# EasyEDA Pro project AUTO_TOOL_VINF_2025-05-17.epro, board PCB1
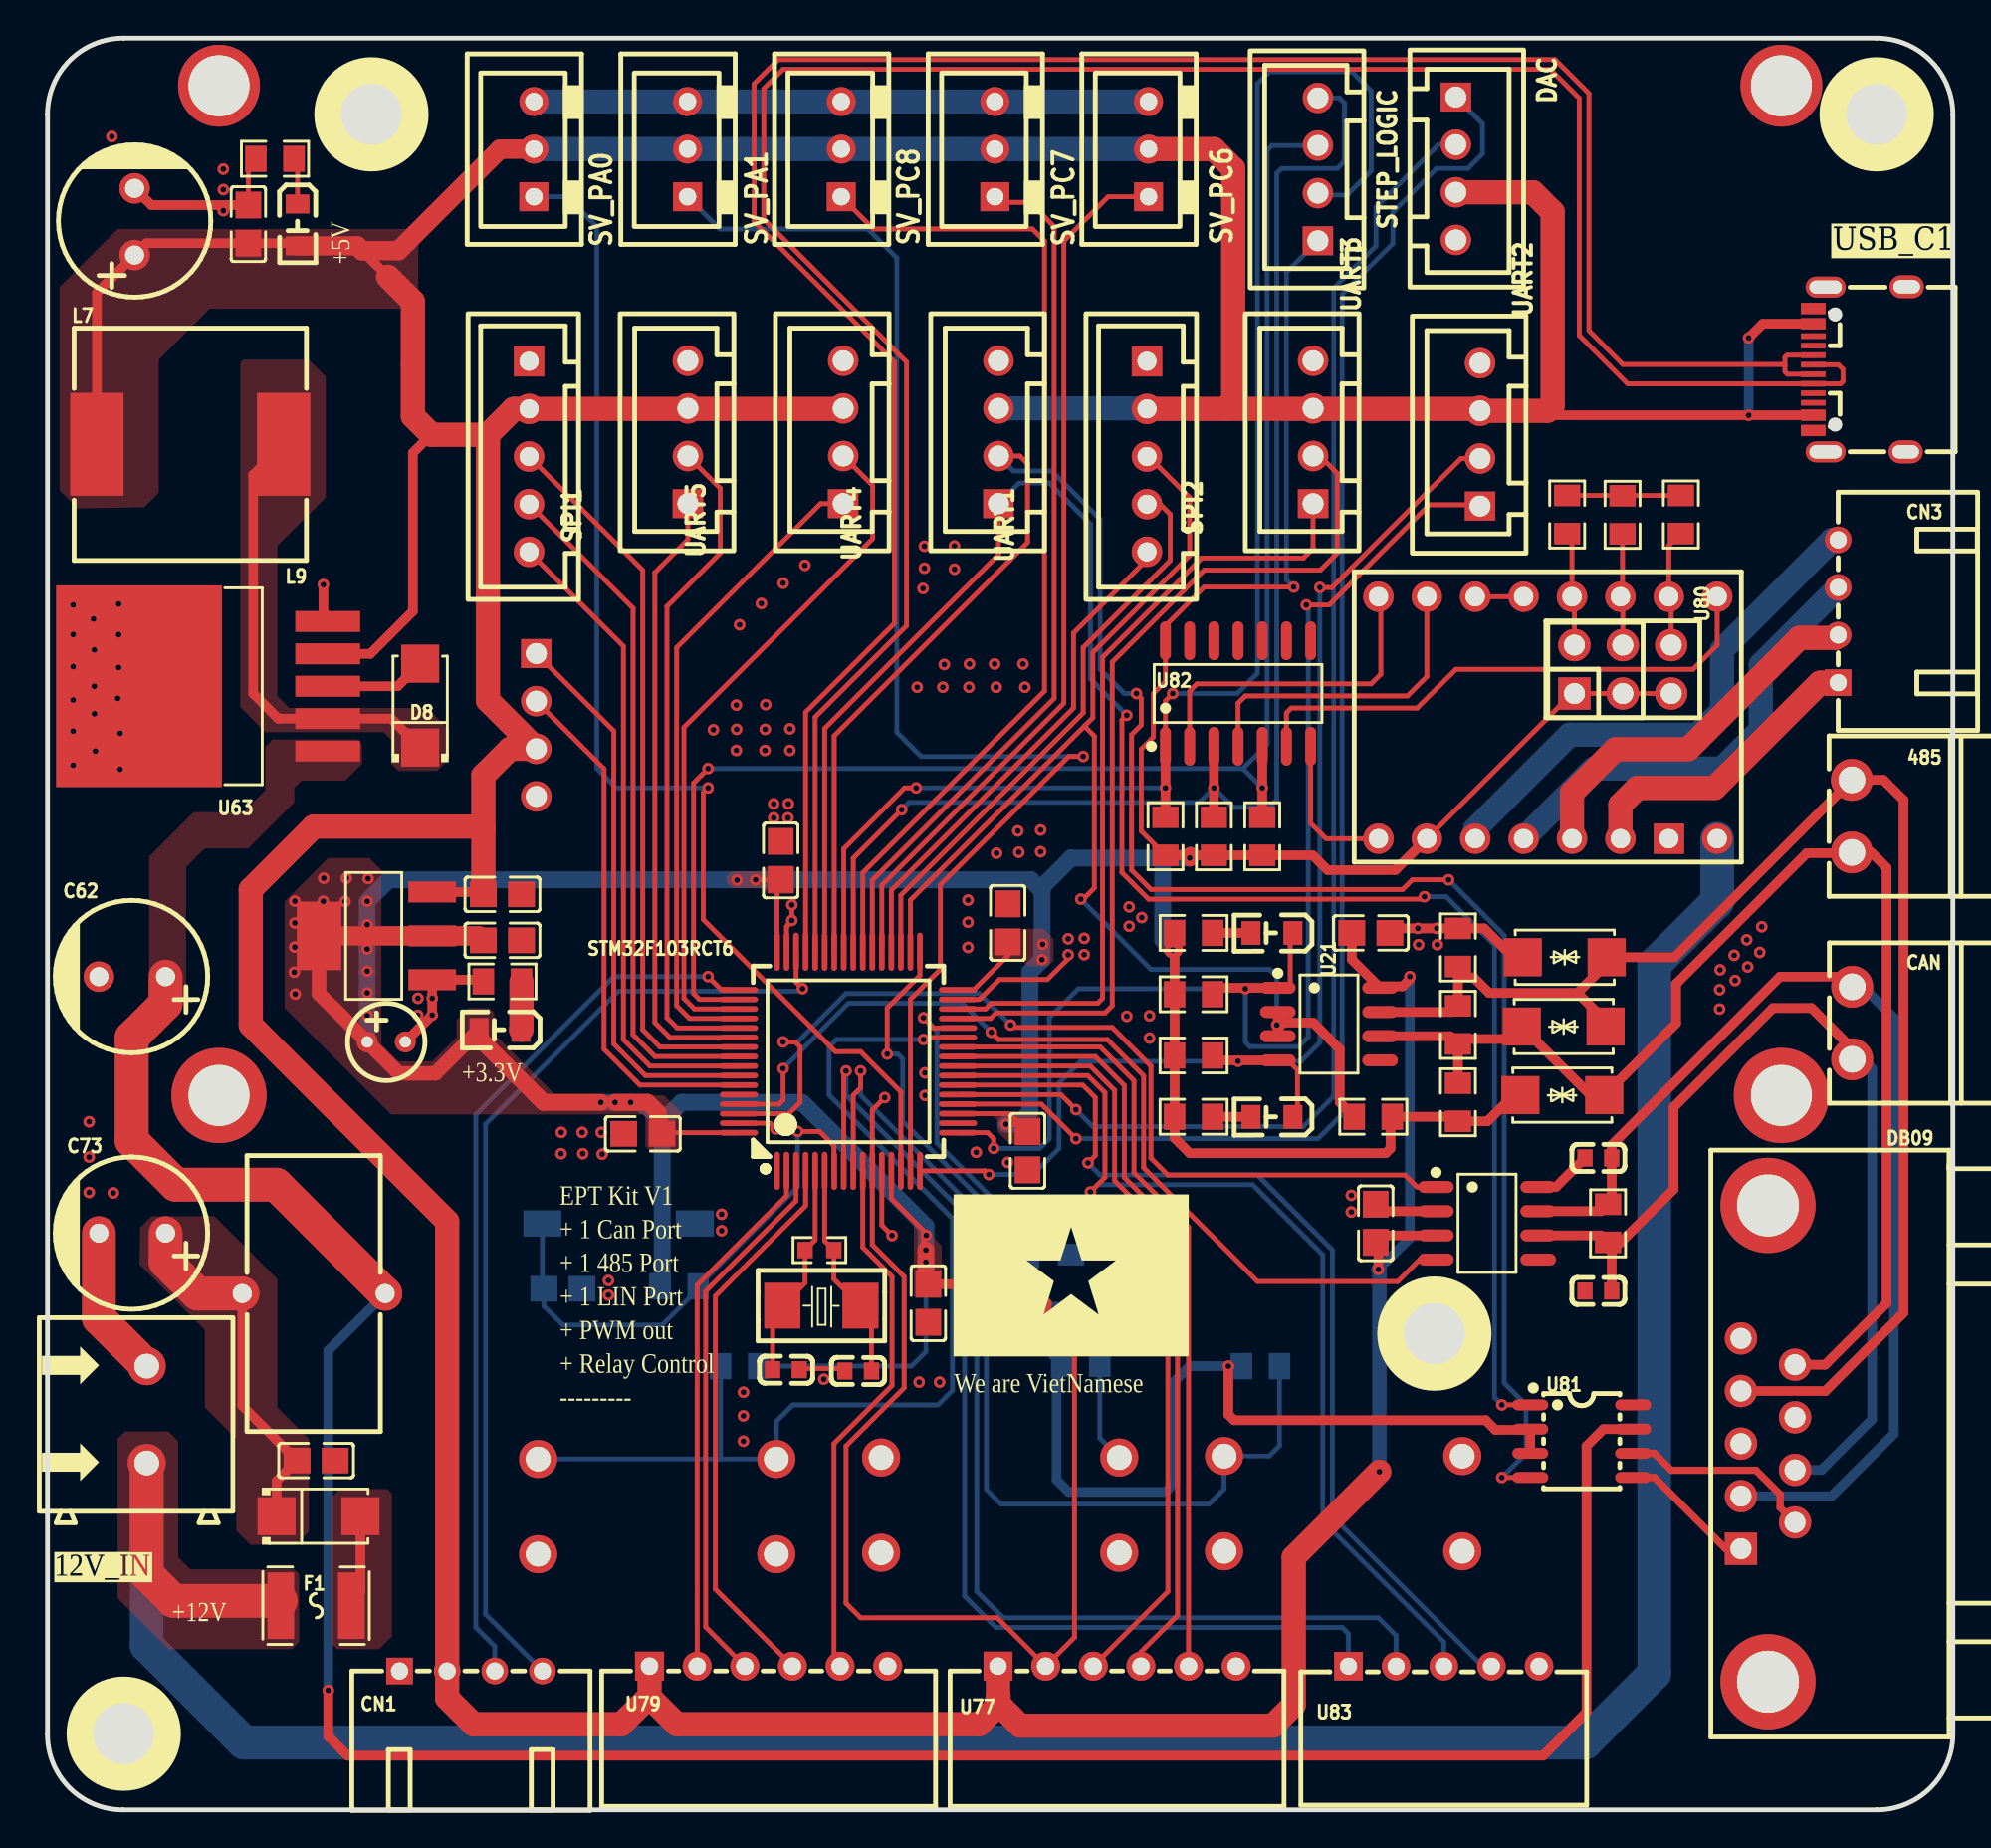
[diagram p1: board, top side]
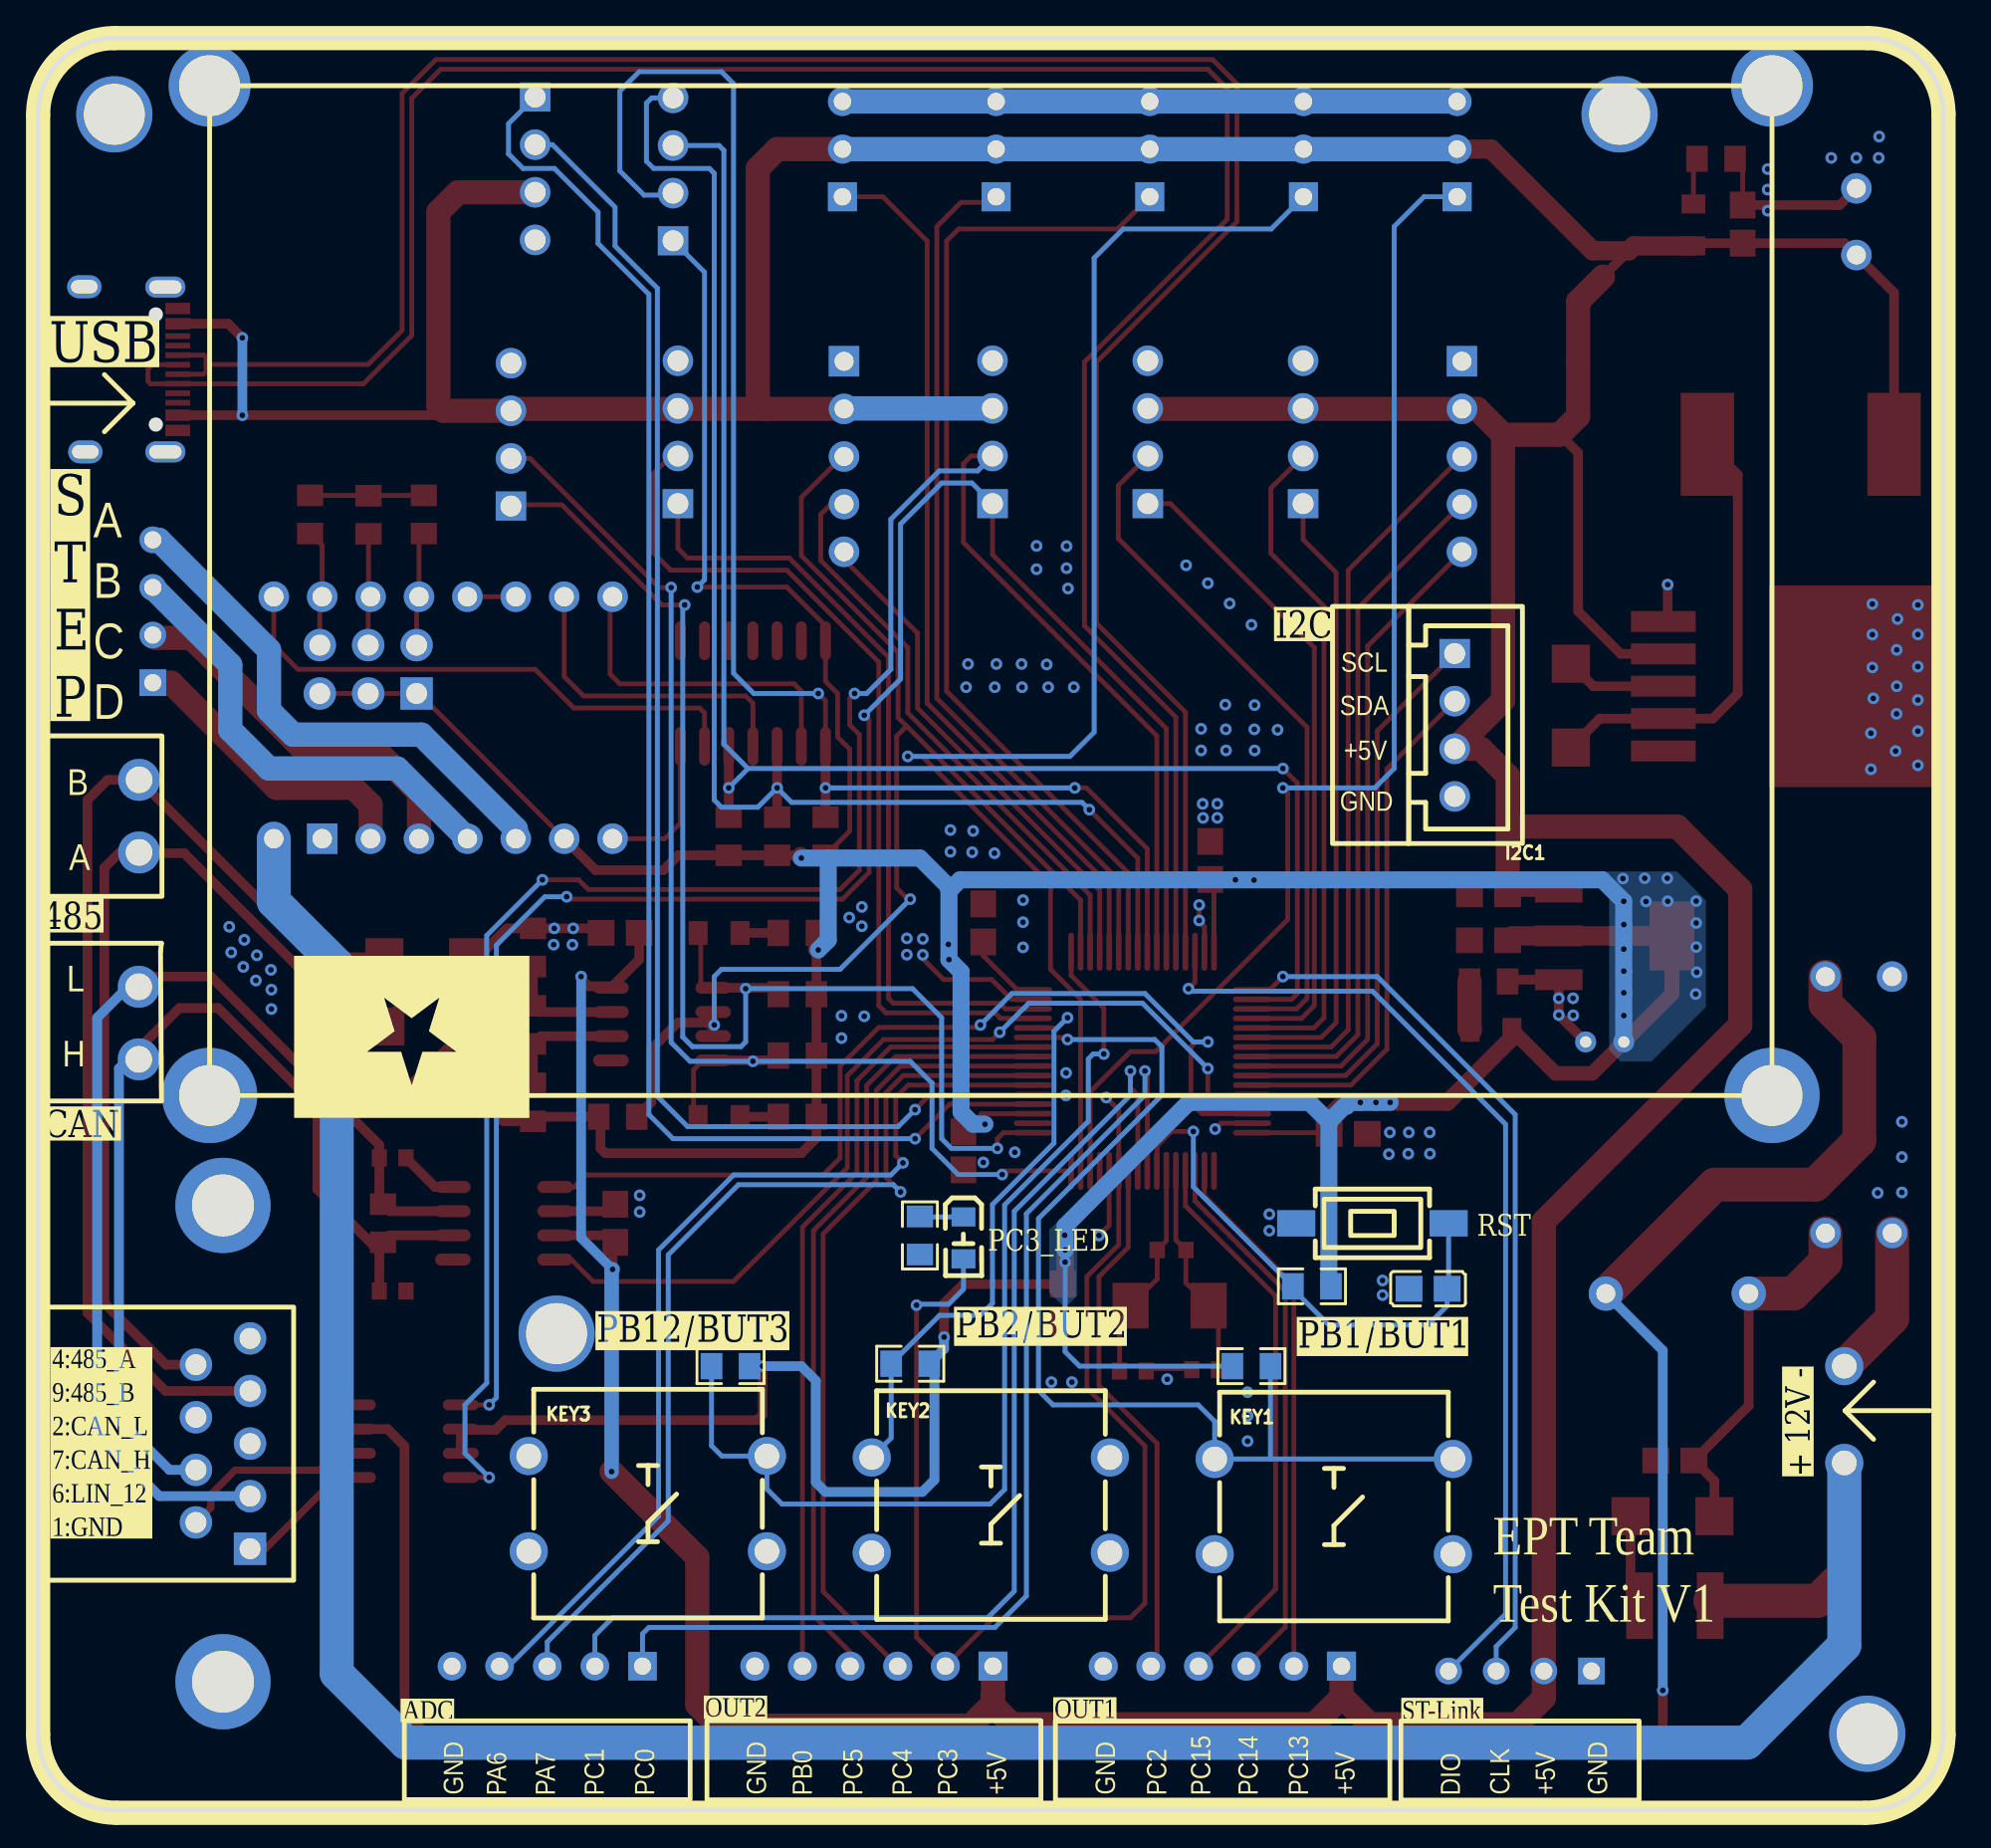
[diagram p2: board, bottom side, seen from below]

Outline 100 x 93 mm; copper layers: Top Layer, Bottom Layer. Coordinates in mm from the lower left corner of the outline.
Outline path: 0,89 arc(1.17,91.83) 4,93 95.98,93 arc(98.82,91.82) 100,88.98 100,4 arc(98.83,1.17) 96,0 3.95,0 arc(1.16,1.16) 0,3.95 0,89
Stack: Top Layer 0.035mm / Dielectric1 1.51mm FR4 er 4.5 / Bottom Layer 0.035mm

## Design rules (mm)
template: Custom Config
spacing copperThickness1oz (default): track to track 0.102, other pairs 0.152 to 0.3
spacing copperThickness2oz: track to track 0.203, other pairs 0.152 to 0.3
track width copperThickness1oz (default): min 0.127, default 0.254, max 2.54
track width copperThickness2oz: min 0.203, default 0.254, max 2.54
differential pair differentialPair (default): width min 0.127, default 0.254, max 2.54; gap min 0.152, default 0.152
via viaSize (default): diameter min 0.5, default 0.61, max 10; hole min 0.3, default 0.305, max 6.3

## Placement (name value [footprint] x y rotation side)
3.3V  17-21SURC/S530-A3/4T  [LED0805-RD_ORANGE]  23.75 40.94 180 top
5V  17-21SURC/S530-A3/4T  [LED0805-RD_ORANGE]  13.12 83.19 270 top
12V_IN  5.08  [CONN-TH_2P-P5.00_WJ500V-5.08-2P]  5.21 20.75 90 top
485  2EDG-3.81-2AW  [CONN-TH_2EDG-3.81-2AW]  94.7 52.16 90 top
C1  22pF  [C0603]  38.75 23.11 180 top
C2  22pF  [C0603]  42.54 23.04 0 top
C19  10uF  [C0805]  23.88 48.06 180 top
C20  100nF  [C0805]  23.88 45.64 0 top
C62  220uF  [CAP-TH_BD8.0-P3.50-D0.6-FD_1]  4.44 43.74 180 top
C63  470uF  [CAP-TH_BD8.0-P3.50-D0.5-FD]  4.57 83.36 90 top
C71  30pF  [C0603]  81.39 34.22 0 top
C72  30pF  [C0603]  81.39 27.24 0 top
C73  220uF  [CAP-TH_BD8.0-P3.50-D0.6-FD_1]  4.44 30.28 180 top
C82  100nF  [C0805]  69.71 30.79 270 top
C84  100nF  [C0805]  10.54 83.24 90 top
C85  100nF  [C0805]  50.39 46.56 90 top
C86  100nF  [C0805]  38.48 49.83 90 top
C87  100nF  [C0805]  51.44 34.59 270 top
C88  100nF  [C0805]  46.23 26.59 270 top
C89  100nF  [C0805]  27.05 27.36 0 bottom
C90  100nF  [C0805]  69.45 46.03 0 top
C93  100nF  [C0805]  14.1 18.34 180 top
C94  100nF  [C0805]  31.24 35.48 180 top
CAN  2EDG-3.81-2AW  [CONN-TH_2EDG-3.81-2AW]  94.72 41.3 90 top
CN1  XD-XH-4AW-G  [CONN-TH_XD-XH-4AW-G]  22.22 7.29 0 top
CN3  STEP  [CONN-TH_XD-XH-4AW-G]  93.98 62.92 90 top
D8  SS34  [SMA_L4.3-W2.6-LS5.2-RD]  19.56 57.96 90 top
D11  SS34  [SMA_L4.3-W2.6-LS5.2-RD]  14.22 15.42 0 top
DAC  ZX-XH2.54-4PZZ  [CONN-TH_4P-P2.50_4PIN]  73.91 86.16 270 top
DB09  DP9  [DSUB-TH_DMR-9P]  90.3 19.23 0 top
F1  BSMD1812-110-24V  [F1812]  14.1 10.72 0 top
H1  PZ254V-12-6P  [HDR-TH_6P-P2.54-V-M-R2-C3-S2.54]  82.68 59.87 0 top
I2C1  ZX-XH2.54-4PZZ  [CONN-TH_4P-P2.50_4PIN]  25.65 56.95 270 bottom
KEY1  B3F-4055  [KEY-TH_4P-L12.0-W12.0-P5.00-LS13.4-EH]  32 15.92 180 bottom
KEY2  B3F-4055  [KEY-TH_4P-L12.0-W12.0-P5.00-LS13.4-EH]  50 16 180 bottom
KEY3  B3F-4055  [KEY-TH_4P-L12.0-W12.0-P5.00-LS13.4-EH]  68 16.07 180 bottom
L7  33uH  [IND-SMD_L12.0-W12.0]  7.49 71.68 0 top
L9  47uH  [IND-TH_L14.5-W7.0-P7.0-D0.6_XR5026T470MVL7]  13.97 27.1 0 top
LED1  17-21SURC/S530-A3/4T  [LED0805-RD_ORANGE]  64.26 36.37 180 top
LED2  17-21SURC/S530-A3/4T  [LED0805-RD_ORANGE]  64.26 46.03 180 top
LED7  17-21SURC/S530-A3/4T  [LED0805-RD_ORANGE]  51.44 30.02 270 bottom
NOREF  -  [Pad_e121]  91 90.5 0 top
NOREF#2  -  [Pad_e2593]  4 4 0 top
NOREF#3  -  [Pad_e2634]  72.79 25 0 top
NOREF#4  -  [Pad_e2590]  96 89 0 top
NOREF#5  -  [Pad_e122]  91 37.5 0 top
NOREF#6  -  [Pad_e2631]  17 89 0 top
NOREF#7  -  [Pad_e123]  9 37.5 0 top
NOREF#8  -  [Pad_e117]  9 90.5 0 top
R32  1MΩ  [R0603]  40.51 29.39 180 top
R82  120Ω  [R0805]  81.9 30.79 90 top
R84  1kΩ  [R0805]  23.88 43.48 0 top
R87  1kΩ  [R0805]  11.94 86.66 0 top
R88  10K  [R0805]  33.15 27.48 180 bottom
R89  1kΩ  [R0805]  60.15 36.38 180 top
R90  1kΩ  [R0805]  60.15 46.03 180 top
R91  10kΩ  [R0805]  60.15 39.6 180 top
R92  10kΩ  [R0805]  69.58 36.38 0 top
R93  10kΩ  [R0805]  60.15 42.81 180 top
R94  47kΩ  [R0805]  74.03 37.14 90 top
R95  47kΩ  [R0805]  74.03 41.21 90 top
R96  47kΩ  [R0805]  74.03 45.27 90 top
R97  1kΩ  [R0805]  53.72 30.15 90 bottom
R98  10kΩ  [R0805]  36.32 23.29 0 bottom
R99  10kΩ  [R0805]  54.23 23.42 180 bottom
R100  10kΩ  [R0805]  63.66 23.29 180 bottom
R101  10K  [R0805]  63.75 51.11 270 top
R102  10K  [R0805]  61.21 51.11 270 top
R103  10K  [R0805]  58.67 51.11 270 top
R104  10K  [R0805]  79.76 68 90 top
R105  10K  [R0805]  82.66 67.98 90 top
R106  10K  [R0805]  85.72 68 90 top
RST1  RST  [SW-SMD_L6.1-W3.6-LS8.0]  29.97 30.78 180 bottom
SPI1  XY-XH2.54-5A11  [HDR-TH_5P-P2.50-V-F-2]  25.27 71.04 270 top
SPI2  XY-XH2.54-5A11  [HDR-TH_5P-P2.50-V-F-2]  57.7 71.04 270 top
STEP_LOGIC  ZX-XH2.54-4PZZ  [CONN-TH_4P-P2.50_4PIN]  66.68 86.11 90 top
STM32F103RCT6  GD32F103RCT6  [LQFP-64_L10.0-W10.0-P0.50-LS12.0-BL]  42.04 39.29 0 top
U5  AMS1117-3.3  [SOT-223-3_L6.5-W3.5-P3.05-LS7.0]  17.22 45.88 0 top
U6  22uF  [CAP-TH_BD4.0-P2.00-D0.5-FD]  17.78 40.31 0 top
U21  MAX485ED  [SOP-8_L4.9-W3.9-P1.27-LS6.0-BL]  67.25 41.25 270 top
U24  SMAJ6.8CA  [SMA_L4.3-W2.6-LS5.1-BI]  79.57 41.12 0 top
U25  SMAJ6.8CA  [SMA_L4.3-W2.6-LS5.1-BI]  79.63 44.75 180 top
U26  SMAJ6.8CA  [SMA_L4.3-W2.6-LS5.1-BI]  79.5 37.52 0 top
U63  LM2596R-5.0  [TO-263-5_L10.2-W8.6-P1.70-LS14.4-TL]  9.75 58.98 180 top
U68  TJA1050DRG  [SOP-8_L4.9-W3.9-P1.27-LS6.0-BL]  75.55 30.79 270 top
U71  XH2.54_3P  [CONN-TH_3P-P2.50_BX-XH2.54-3PZZ]  25.53 87.17 90 top
U72  BX-XH2.54-3PZZ  [CONN-TH_3P-P2.50_BX-XH2.54-3PZZ]  41.66 87.17 90 top
U74  BX-XH2.54-3PZZ  [CONN-TH_3P-P2.50_BX-XH2.54-3PZZ]  49.72 87.17 90 top
U75  BX-XH2.54-3PZZ  [CONN-TH_3P-P2.50_BX-XH2.54-3PZZ]  33.59 87.17 90 top
U76  BX-XH2.54-3PZZ  [CONN-TH_3P-P2.50_BX-XH2.54-3PZZ]  57.78 87.17 90 top
U77  6P_RELAY  [CONN-TH_6P-P2.50_WAFER-XH254WZ-6A]  56.13 7.54 0 top
U79  6P_RELAY  [CONN-TH_6P-P2.50_WAFER-XH254WZ-6A]  37.85 7.54 0 top
U80  A4988  [DIP-16_L20.3-W15.2-P2.54_LS12.7_A4988]  78.74 57.33 270 top
U81  TJA1021T/20/C,118  [SO-8_L4.9-W3.9-P1.27-LS5.9-BL]  80.52 19.35 270 top
U82  74HC14  [SOIC-14_L8.7-W3.9-P1.27-LS6.0-BL]  62.48 58.6 0 top
U83  5P_ADC  [CONN-TH_5P-P2.50_WAFER-XH254WZ-5A]  73.28 7.54 0 top
UART1  ZX-XH2.54-4PZZ  [CONN-TH_4P-P2.50_4PIN]  49.91 72.31 90 top
UART2  ZX-XH2.54-4PZZ  [CONN-TH_4P-P2.50_4PIN]  75.18 72.19 90 top
UART3  ZX-XH2.54-4PZZ  [CONN-TH_4P-P2.50_4PIN]  66.42 72.31 90 top
UART4  ZX-XH2.54-4PZZ  [CONN-TH_4P-P2.50_4PIN]  41.76 72.31 90 top
UART5  ZX-XH2.54-4PZZ  [CONN-TH_4P-P2.50_4PIN]  33.61 72.31 90 top
USB_C1  918-418K2023S40001  [USB-C-SMD_TYPE-C-USB-17]  95.12 75.62 90 top
X1  8MHz  [OSC-SMD_L5.0-W3.2]  40.62 26.47 0 top

## Footprints (pads in the part's own frame, mm; a bottom-side part is the same pattern mirrored in y, then rotated)
C0603
  rect 0.8x0.9 smd: 1(-0.7,0) 2(0.7,0)
C0805
  rect 1.41x1.35 smd: 1(-1,0) 2(1,0)
CAP-TH_BD4.0-P2.00-D0.5-FD
  round 1.1 hole 0.6: 1(-1,0) 2(1,0)
CAP-TH_BD8.0-P3.50-D0.5-FD
  round 1.6 hole 1: 1(-1.75,0) 2(1.75,0)
CAP-TH_BD8.0-P3.50-D0.6-FD_1
  round 1.6 hole 1: 1(-1.75,0) 2(1.75,0)
CONN-TH_2EDG-3.81-2AW
  round 2.2 hole 1.4: 1(-1.905,0) 2(1.905,0)
CONN-TH_2P-P5.00_WJ500V-5.08-2P
  round 2 hole 1.3: 1(-2.54,0) 2(2.54,0)
CONN-TH_3P-P2.50_BX-XH2.54-3PZZ
  rect 1.524x1.524 hole 0.914: 1(-2.5,0)
  round 1.524 hole 0.914: 2(0,0) 3(2.5,0)
CONN-TH_4P-P2.50_4PIN
  rect 1.524x1.6 hole 1.1: 1(-3.75,0)
  round 1.6 hole 1.1: 2(-1.25,0) 3(1.25,0) 4(3.75,0)
CONN-TH_5P-P2.50_WAFER-XH254WZ-5A
  rect 1.5x1.5 hole 0.9: 1(-5,0)
  round 1.5 hole 0.9: 2(-2.5,0) 3(0,0) 4(2.5,0) 5(5,0)
CONN-TH_6P-P2.50_WAFER-XH254WZ-6A
  rect 1.524x1.524 hole 0.914: 1(-6.25,0)
  round 1.524 hole 0.914: 2(-3.75,0) 3(-1.25,0) 4(1.25,0) 5(3.75,0) 6(6.25,0)
CONN-TH_XD-XH-4AW-G
  rect 1.4x1.4 hole 0.9: 1(-3.75,0)
  round 1.4 hole 0.9: 2(-1.25,0) 3(1.25,0) 4(3.75,0)
DIP-16_L20.3-W15.2-P2.54_LS12.7_A4988
  round 1.6 hole 1.02: 1(-6.35,8.89) 2(-6.35,6.35) 3(-6.35,3.81) 4(-6.35,1.27) 5(-6.35,-1.27) 6(-6.35,-3.81) 7(-6.35,-6.35) 8(-6.35,-8.89) 9(6.35,-8.89) 10(6.35,-6.35) 11(6.35,-3.81) 12(6.35,-1.27) 13(6.35,1.27) 14(6.35,3.81) 16(6.35,8.89)
  rect 1.6x1.6 hole 1.02: 15(6.35,6.35)
DSUB-TH_DMR-9P
  rect 1.7x1.7 hole 1.1: 1(-1.42,-5.52)
  round 1.7 hole 1.1: 2(-1.42,-2.76) 3(-1.42,0) 4(-1.42,2.76) 5(-1.42,5.52) 6(1.42,-4.14) 7(1.42,-1.38) 8(1.42,1.38) 9(1.42,4.14)
  round 5 hole 3.25: 10(0,12.5) 11(0,-12.5)
F1812
  rect 1.407x3.499 smd: 1(-1.853,0) 2(1.853,0)
HDR-TH_5P-P2.50-V-F-2
  rect 1.6x1.6 hole 1: 1(-5,0)
  round 1.6 hole 1: 2(-2.5,0) 3(0,0) 4(2.5,0) 5(5,0)
HDR-TH_6P-P2.54-V-M-R2-C3-S2.54
  rect 1.7x1.7 hole 1.1: 1(-2.54,-1.27)
  round 1.7 hole 1.1: 2(-2.54,1.27) 3(0,-1.27) 4(0,1.27) 5(2.54,-1.27) 6(2.54,1.27)
IND-SMD_L12.0-W12.0
  rect 2.8x5.4 smd: 1(4.9,0) 2(-4.9,0)
IND-TH_L14.5-W7.0-P7.0-D0.6_XR5026T470MVL7
  round 1.8 hole 1: 1(-3.75,0) 2(3.75,0)
KEY-TH_4P-L12.0-W12.0-P5.00-LS13.4-EH
  round 2 hole 1.3: 1(6.25,-2.5) 2(-6.25,-2.5) 3(6.25,2.5) 4(-6.25,2.5)
LED0805-RD_ORANGE
  rect 1x1.25 smd: 1(-1.1,0) 2(1.1,0)
LQFP-64_L10.0-W10.0-P0.50-LS12.0-BL
  oval 0.3x2 smd: 1(-3.75,-5.75) 2(-3.25,-5.75) 3(-2.75,-5.75) 4(-2.25,-5.75) 5(-1.75,-5.75) 6(-1.25,-5.75) 7(-0.75,-5.75) 8(-0.25,-5.75) 9(0.25,-5.75) 10(0.75,-5.75) 11(1.25,-5.75) 12(1.75,-5.75) 13(2.25,-5.75) 14(2.75,-5.75) 15(3.25,-5.75) 16(3.75,-5.75) 33(3.75,5.75) 34(3.25,5.75) 35(2.75,5.75) 36(2.25,5.75) 37(1.75,5.75) 38(1.25,5.75) 39(0.75,5.75) 40(0.25,5.75) 41(-0.25,5.75) 42(-0.75,5.75) 43(-1.25,5.75) 44(-1.75,5.75) 45(-2.25,5.75) 46(-2.75,5.75) 47(-3.25,5.75) 48(-3.75,5.75)
  oval 2x0.3 smd: 17(5.75,-3.75) 18(5.75,-3.25) 19(5.75,-2.75) 20(5.75,-2.25) 21(5.75,-1.75) 22(5.75,-1.25) 23(5.75,-0.75) 24(5.75,-0.25) 25(5.75,0.25) 26(5.75,0.75) 27(5.75,1.25) 28(5.75,1.75) 29(5.75,2.25) 30(5.75,2.75) 31(5.75,3.25) 32(5.75,3.75) 49(-5.75,3.75) 50(-5.75,3.25) 51(-5.75,2.75) 52(-5.75,2.25) 53(-5.75,1.75) 54(-5.75,1.25) 55(-5.75,0.75) 56(-5.75,0.25) 57(-5.75,-0.25) 58(-5.75,-0.75) 59(-5.75,-1.25) 60(-5.75,-1.75) 61(-5.75,-2.25) 62(-5.75,-2.75) 63(-5.75,-3.25) 64(-5.75,-3.75)
OSC-SMD_L5.0-W3.2
  rect 1.9x2.4 smd: 1(-2.05,0) 2(2.05,0)
Pad_e117
  round 4.3 hole 3.2: 65(0,0)
Pad_e121
  round 4.3 hole 3.2: 65(0,0)
Pad_e122
  round 5 hole 3.2: 65(0,0)
Pad_e123
  round 5 hole 3.2: 65(0,0)
Pad_e2590
  round 4 hole 3.2: 66(0,0)
Pad_e2593
  round 4 hole 3.2: 66(0,0)
Pad_e2631
  round 4 hole 3.2: 66(0,0)
Pad_e2634
  round 4 hole 3.2: 66(0,0)
R0603
  rect 0.806x0.864 smd: 1(-0.753,0) 2(0.753,0)
R0805
  rect 1.133x1.377 smd: 1(-1,0) 2(1,0)
SMA_L4.3-W2.6-LS5.1-BI
  rect 2x2 smd: 1(-2.2,0) 2(2.2,0)
SMA_L4.3-W2.6-LS5.2-RD
  rect 2x2 smd: 1(-2.2,0) 2(2.2,0)
SO-8_L4.9-W3.9-P1.27-LS5.9-BL
  oval 0.574x1.888 smd: 1(-1.905,-2.699) 2(-0.635,-2.699) 3(0.635,-2.699) 4(1.905,-2.699) 5(1.905,2.699) 6(0.635,2.699) 7(-0.635,2.699) 8(-1.905,2.699)
SOIC-14_L8.7-W3.9-P1.27-LS6.0-BL
  oval 0.574x2.038 smd: 1(-3.81,-2.769) 2(-2.54,-2.769) 3(-1.27,-2.769) 4(0,-2.769) 5(1.27,-2.769) 6(2.54,-2.769) 7(3.81,-2.769) 8(3.81,2.769) 9(2.54,2.769) 10(1.27,2.769) 11(0,2.769) 12(-1.27,2.769) 13(-2.54,2.769) 14(-3.81,2.769)
SOP-8_L4.9-W3.9-P1.27-LS6.0-BL
  oval 0.63x1.865 smd: 1(-1.905,-2.683) 2(-0.635,-2.683) 3(0.635,-2.683) 4(1.905,-2.683) 5(1.905,2.683) 6(0.635,2.683) 7(-0.635,2.683) 8(-1.905,2.683)
SOT-223-3_L6.5-W3.5-P3.05-LS7.0
  rect 2.5x1.1 smd: 1(2.97,-2.3) 2(2.97,0) 3(2.97,2.3)
  rect 2.34x3.6 smd: 4(-2.97,0)
SW-SMD_L6.1-W3.6-LS8.0
  rect 2x1.38 smd: 1(-4,0) 2(4,0)
TO-263-5_L10.2-W8.6-P1.70-LS14.4-TL
  rect 3.4x1.1 smd: 1(-4.953,3.4) 2(-4.953,1.7) 3(-4.953,0) 4(-4.953,-1.7) 5(-4.953,-3.4)
  rect 8.705x10.587 smd: 6(4.953,0)
USB-C-SMD_TYPE-C-USB-17
  oval 1.1x2.1 hole 0.7x1.7: 0(-4.334,1.802) 0(4.316,1.802)
  oval 1.2x1.8 hole 0.7x1.4: 0(-4.334,-2.398) 0(4.334,-2.453)
  rect 0.6x1.3 smd: A1(-3.209,2.451) A4(-2.409,2.451) A9(2.391,2.452) A12(3.191,2.451)
  rect 0.3x1.3 smd: A5(-1.259,2.451) A6(-0.259,2.451) A7(0.241,2.451) A8(1.24,2.453) B5(1.741,2.451) B6(0.741,2.451) B7(-0.759,2.451) B8(-1.759,2.453)

## Nets
As in the schematic, except:
GND: 12V_IN.2 C1.1 C2.1 C19.1 C20.2 C62.2 C63.2 C71.1 C72.1 C73.2 C82.1 C84.2 C85.2 C86.2 C87.2 C88.2 C89.2 C90.2 C93.1 C94.2 CN1.1 D8.2 DAC.4 DB09.1 I2C1.4 KEY1.1 KEY1.2 KEY2.1 KEY2.2 KEY3.1 KEY3.2 NOREF#2.66 NOREF#3.66 NOREF#4.66 NOREF#6.66 R84.1 R87.1 R96.2 R97.1 R104.2 R105.2 R106.2 RST1.1 SPI1.1 SPI2.1 STM32F103RCT6.12 STM32F103RCT6.18 STM32F103RCT6.31 STM32F103RCT6.47 STM32F103RCT6.63 U5.1 U6.2 U21.5 U25.2 U63.3 U63.5 U63.6 U68.2 U68.8 U71.3 U72.3 U74.3 U75.3 U76.3 U77.6 U79.6 U80.9 U80.15 U81.5 U82.7 U83.5 UART1.4 UART2.4 UART3.4 UART4.4 UART5.4 USB_C1.0 USB_C1.A1 USB_C1.A12
PB1/BUT1: KEY1.3 KEY1.4 R98.1 STM32F103RCT6.27
PB2/BUT2: KEY2.4 R99.1 STM32F103RCT6.28
PB12/BUT3: KEY3.3 R100.1 STM32F103RCT6.33

Pads without a net: DB09 3 5 8 10 11; KEY2 3; KEY3 4; NOREF 65; NOREF#5 65; NOREF#7 65; NOREF#8 65; STM32F103RCT6 1 60; U68 5; U81 8; U82 8 9 10 11 12 13; USB_C1 A5 A8 B5 B8

## Via types
v1: diameter 0.61, hole 0.305, Top Layer to Bottom Layer, 200 vias

## Routing (per net, layer and track width the routed paths; a pad name or vN(x,y) marks a point on that pad's centre or on a via; arc(x,y) is an arc through that point)
3.3V: length 332.1
  Top Layer w0.254: v1(65.41,64.19) 60.71,64.19 58.67,62.15 U82.14 58.67,59.23 58.04,58.6 58.04,56.31 57.4,55.68 57.4,51.38 R103.2 ; 32.24,35.74 32.44,35.54 STM32F103RCT6.64 ; 51.04,35.99 C87.1 ; 51.04,35.99 50.49,36.54 STM32F103RCT6.19 ; 51.04,35.99 v1(50.31,35.99) ; U80.10 80.01,58.6 H1.1 H1.3 H1.5 ; C85.1 50.42,45.53 50.42,44.86 48.61,43.04 STM32F103RCT6.32 ; v1(37.16,48.82) 38.47,48.82 ; 38.47,48.82 38.29,48.64 STM32F103RCT6.48 ; 38.47,48.82 C86.1 ; STM32F103RCT6.13 44.29,32.09 45.97,30.4 45.97,27.59
  Top Layer w0.508: U81.2 77.82,19.95 ; 77.82,19.95 75.99,19.95 75.48,20.46 62.27,20.46 61.98,20.75 v1(61.98,23.29) ; 77.82,19.95 U81.3 ; C88.1 51.45,27.59 52.45,26.59 v1(52.45,24.82) ; R103.2 R102.2 R101.2 66.41,50.11 67.18,49.33 70.74,49.33 U80.10 ; 77.37,37.94 75.57,36.14 R94.1 73.79,36.38 R92.2 70.49,36.28 70.49,34.72 70.23,34.47 59.94,34.47 59.15,35.26 R89.2 R91.2 R93.2 R90.2 ; 14.25,45.24 U5.4
  Top Layer w0.762: 14.25,45.24 14.25,42.84 U6.1 18.43,38.66 20.36,38.66 3.3V.2
  Top Layer w0.889: 59.99,50.11 59.99,50.01 v1(59.94,49.96) ; v1(29.79,37.14) v1(30.61,37.14) 31.5,37.14 32.05,36.58 32.05,36.39 ; 32.05,36.39 32.24,35.74 ; 32.05,36.39 32.05,35.68 C94.1 ; v1(59.06,45.14) 59.11,45.14 59.15,45.17 ; v1(46.1,29.39) v1(46.1,28.75) 46.1,27.72 C88.1 ; 3.3V.2 22.65,40.52 26.03,37.14 v1(29.04,37.14)
  Top Layer w1.016: C20.1 22.64,45.88 U5.2 U5.4
  Bottom Layer w0.254: R100.2 v1(61.98,23.29) ; STEP_LOGIC.1 65.02,80.71 65.02,64.57 v1(65.41,64.19) ; v1(46.1,29.39) v1(46.1,28.75) 46.1,24.05 45.34,23.29 R98.2
  Bottom Layer w0.508: v1(61.98,23.29) 59.94,23.29 59.18,22.53 59.18,17.2 58.67,16.69 53.59,16.69 52.96,17.32 52.96,23.15 R99.2 52.45,24.2 v1(52.45,24.82)
  Bottom Layer w0.889: 58.53,49.96 58.53,45.66 v1(59.06,45.14) ; 58.53,49.96 v1(59.94,49.96) ; 58.53,49.96 53.72,49.96 52.2,48.44 52.2,48.23 ; 32.26,36.12 31.44,36.93 31.32,36.93 ; 32.26,36.12 33.27,37.14 39.61,37.14 46.1,30.64 v1(46.1,29.39) ; 32.26,36.12 32.26,27.59 R88.2 ; v1(29.04,37.14) v1(29.79,37.14) v1(30.61,37.14) 31.24,37.14 ; 52.2,48.23 v1(52.2,44.63) 51.56,43.99 51.56,36.63 50.93,35.99 v1(50.31,35.99) ; 52.2,48.23 51.61,48.82 v1(37.16,48.82) 17.91,48.82 v1(16.78,47.69) v1(16.78,46.47) v1(16.78,45.18) v1(16.78,44.03) v1(16.78,42.89) v1(16.78,41.69) U6.1
  vias: v1(12.98,47.7) v1(12.98,46.55) v1(12.98,45.29) v1(12.95,43.97) v1(13,42.82) v1(14.5,48.9) v1(14.47,47.69) v1(15.62,47.68) v1(15.68,48.9) v1(16.83,48.89) v1(36.19,48.8) v1(46.12,30.16) v1(52.23,45.43)
+5V: length 395.9
  Top Layer w0.508: v1(89.28,73.2) 89.3,73.2 89.3,73.21 ; L7.2 2.59,79.63 C63.1 5.19,82.24 C84.1 12.98,82.24 5V.2 ; C90.1 68.45,44.63 69.86,43.23 ; 69.86,43.23 71.12,43.23 71.5,43.61 v1(71.5,43.74) ; 69.86,43.23 U21.8 ; 20.15,72.18 20.12,72.18 19.18,71.23 19.18,62.92 16.94,60.68 14.48,60.68 ; USB_C1.A4 89.3,73.21 ; 89.3,73.21 75.41,73.21 UART2.3 ; U68.3 70.07,30.16 C82.2 69.85,29.65 v1(69.85,28.37) ; USB_C1.A9 90.02,78.01 v1(89.28,77.27) ; 19.18,75.87 19.18,75.92 ; C19.2 22.76,48.18 U5.3 ; 17.87,80.47 16.51,81.84
  Top Layer w1.016: U71.2 23.75,87.17 18.42,81.84 16.51,81.84 16.26,82.09 5V.2
  Top Layer w1.27: 49.91,5.56 49.91,6.02 49.88,6.05 ; 49.91,5.56 49.88,5.59 49.88,6.05 ; 49.91,5.56 51.05,4.42 64.31,4.42 65.41,5.51 65.41,13.26 v1(69.9,17.75) ; 49.91,5.56 49.91,5.51 48.9,4.5 33.02,4.5 31.75,5.77 ; 61.8,73.54 61.8,73.58 ; 61.8,73.54 SPI2.2 ; 61.8,73.54 75.08,73.54 UART2.3 78.72,73.44 78.99,73.71 78.99,83.87 77.96,84.91 DAC.3 ; 61.8,73.54 62.23,73.97 62.23,86.16 61.21,87.17 U76.2 ; 19.18,75.87 19.18,73.15 20.15,72.18 23.11,72.18 ; U79.1 31.6,5.97 30.12,4.5 22.35,4.5 20.97,5.87 CN1.2 20.97,30.89 10.67,41.2 10.67,48.31 13.97,51.61 22.8,51.61 22.88,51.53 ; 22.88,51.53 22.88,54.3 24.28,55.7 I2C1.3 23.11,58.24 23.11,72.18 ; 22.88,51.53 C19.2 ; 17.87,80.47 19.18,79.17 19.18,75.92 ; 49.88,6.05 U77.1 ; UART4.3 41.73,73.54 SPI1.2 24.47,73.54 23.11,72.18
  Bottom Layer w0.508: v1(69.85,28.37) 71.5,30.02 v1(71.5,43.74) ; v1(89.28,77.27) v1(89.28,73.2)
  Bottom Layer w0.762: v1(69.85,28.37) 69.9,28.32 v1(69.9,17.75)
  Bottom Layer w1.27: UART1.3 57.68,73.56 SPI2.2 ; U76.2 U74.2 U72.2 U75.2 U71.2
+12V: length 134.6
  Top Layer w0.508: v1(14.73,6.27) 14.73,3.86 15.75,2.84 78.49,2.84 80.77,5.13 80.77,19.1 81.66,19.99 U81.7
  Top Layer w1.778: L9.2 12,32.82 6.73,32.82 4.42,35.13 4.42,40.54 6.19,42.31 C62.1
  Bottom Layer w0.508: L9.2 14.73,24.11 v1(14.73,6.27)
GND: length 115.9
  Top Layer w0.254: STM32F103RCT6.31 48.91,42.54 49.96,43.59 52.48,43.59 53.57,44.68 v1(53.57,44.88) ; R104.2 R106.2 ; STM32F103RCT6.63 37.92,36.04 v1(38.23,35.74) ; STM32F103RCT6.47 38.79,46.36 38.86,46.43 38.86,46.48 v1(39.06,46.69) v1(39.06,47.5) ; C84.2 10.54,86.27 R87.1 ; STM32F103RCT6.12 43.79,30.69 v1(44.32,30.15) ; U80.9 67.11,50.98 66.29,51.79 U82.7 ; C2.1 41.72,23.17 39.88,23.17
  Top Layer w0.381: DB09.1 88.07,13.71 84.33,17.45 U81.5
  Top Layer w0.508: U68.8 79.17,32.7 C71.1 ; C90.2 70.69,46.27 v1(71.92,46.27) v1(72.91,46.27) R96.2 75.4,46.27 77.37,44.3 ; U68.2 70.07,31.43 C82.1 ; C63.2 5.45,84.24 C84.2 ; R84.1 22.78,43.58 U5.1 v1(20.19,42.6) v1(20.19,41.72) U6.2 ; 14.48,62.38 v1(14.48,64.31) ; D8.2 18.37,58.98 14.48,58.98
  Top Layer w1.778: 12V_IN.2 2.69,25.8 C73.2
  Bottom Layer w0.254: v1(44.32,30.15) 44.32,30.02
  Bottom Layer w1.27: U71.3 U75.3 U72.3 U74.3 U76.3
  vias: v1(1.35,63.25) v1(1.35,61.7) v1(1.35,60.01) v1(1.35,58.26) v1(1.35,56.62) v1(1.35,54.83) v1(2.18,36.12) v1(2.18,34.27) v1(2.18,32.41) v1(2.41,62.51) v1(2.45,60.89) v1(2.45,58.98) v1(2.46,57.53) v1(2.51,55.58) v1(3.38,87.83) v1(3.4,86.71) v1(3.45,32.39) v1(3.73,63.3) v1(3.73,61.69) v1(3.73,59.96) v1(3.68,58.34) v1(3.81,56.52) v1(3.81,54.62) v1(4.57,86.71) v1(5.89,86.71) v1(9.23,86.12) v1(9.23,85.05) v1(9.23,83.94) v1(19.44,42.6) v1(19.43,41.71) v1(26.96,35.56) v1(26.95,34.44) v1(28.06,35.56) v1(28.09,34.44) v1(29.06,35.56) v1(29.11,34.42) v1(29.44,27.79) v1(29.44,27.02) v1(34.95,56.69) v1(35.38,31.27) v1(35.38,30.4) v1(36.15,57.99) v1(36.17,56.72) v1(36.15,55.61) v1(36.32,62.2) v1(36.53,21.92) v1(36.53,20.68) v1(36.53,19.35) v1(37.47,63.32) v1(37.69,58.01) v1(37.67,56.72) v1(37.66,55.61) v1(38.11,52.81) v1(38.11,52.07) v1(38.61,64.39) v1(38.88,52.81) v1(38.86,52.07) v1(38.96,56.74) v1(38.96,55.61) v1(39.75,65.33) v1(40.74,22.61) v1(45.64,58.93) v1(45.75,22.45) v1(45.95,64.11) v1(46.03,66.33) v1(46.03,65.18) v1(46.05,38.68) v1(46.06,37.5) v1(46.82,22.45) v1(46.99,58.93) v1(47.07,60.12) v1(47.6,66.34) v1(47.6,65.12) v1(48.31,47.75) v1(48.31,46.59) v1(48.31,45.27) v1(48.39,60.15) v1(48.36,58.93) v1(48.74,34.52) v1(49.71,60.15) v1(49.79,58.93) v1(49.81,50.22) v1(50.39,33.99) v1(50.93,51.38) v1(50.98,50.27) v1(51.2,60.15) v1(51.3,58.93) v1(52.12,51.44) v1(52.12,50.29) v1(53.57,45.72) v1(54.41,45.75) v1(54.41,44.89) v1(56.64,41.66) v1(56.77,47.4) v1(56.77,46.38) v1(57.43,46.84) v1(57.84,41.68) v1(57.84,40.51) v1(68.43,32.26) v1(68.43,31.39) v1(71.96,45.42) v1(72.94,45.42) v1(87.78,44.09) v1(87.76,43.05) v1(87.76,42.04) v1(88.52,44.86) v1(88.57,43.54) v1(89.18,45.67) v1(89.23,44.25) v1(89.87,45.01) v1(89.97,46.36)
485_A: length 66.7
  Top Layer w0.508: U21.6 73.62,40.61 73.77,40.46 ; R94.2 R95.1 73.77,40.46 ; 73.77,40.46 76.72,40.46 U24.1 80.98,37.52 U26.2 85.47,41.28 85.47,43.36 92.33,50.22 94.66,50.22 485.1 95.72,50.26 96.52,49.45 96.52,26.59 93.29,23.37 DB09.9
485_B: length 75.6
  Top Layer w0.508: 74.03,43.69 R95.2 73.7,41.88 U21.7 ; 74.03,43.69 R96.1 ; 74.03,43.69 74.85,43.69 75.66,42.88 80.3,42.88 ; 80.3,42.88 81.53,44.12 ; 80.3,42.88 81.77,41.41 U24.2 ; DB09.4 93.31,21.99 97.41,26.09 97.41,53.01 96.35,54.07 485.2 85.39,44.75 U25.1 ; 81.53,44.12 81.53,44.46 U25.1 ; 81.53,44.12 81.83,44.42 U25.1
BF12: length 151
  Top Layer w1.778: 12V_IN.1 5.21,12.37 6.6,10.97 12.24,10.97
  Bottom Layer w1.778: 12V_IN.1 5.21,8.64 10.31,3.53 80.7,3.53 84.33,7.16 84.33,44.37 87.63,47.68 U80.16
CAN_RX: length 49.1
  Top Layer w0.254: STM32F103RCT6.61 38.39,37.04 38.61,37.26 v1(38.61,38.91) ; U68.4 72.02,28.89 70.87,27.74 63.5,27.74 57.53,33.71 57.53,38.53 55.63,40.44 49.91,40.44 v1(49.53,40.82)
  Bottom Layer w0.254: v1(49.53,40.82) 48.01,42.34 42.04,42.34 v1(38.61,38.91)
CAN_TX: length 49.7
  Top Layer w0.254: STM32F103RCT6.62 38.91,36.54 39.5,37.14 39.5,40.06 39.24,40.31 v1(38.61,40.31) ; U68.1 71.88,32.7 71.25,33.33 58.8,33.33 57.91,34.21 57.91,39.04 55.88,41.07 50.67,41.07 v1(50.55,41.2)
  Bottom Layer w0.254: v1(50.55,41.2) 48.9,42.85 41.91,42.85 39.37,40.31 v1(38.61,40.31)
CANH_PIN7: length 52.8
  Top Layer w0.508: U68.6 81.54,30.16 R82.1 82.09,29.6 82.09,29.32 ; 82.09,29.32 85.34,32.57 85.34,36.88 90.55,42.09 92.58,42.09 94.74,39.93 ; 82.09,29.32 C72.2
  Bottom Layer w0.508: DB09.7 93.11,17.85 95.76,20.5 95.76,38.91 94.74,39.93
CANL_PIN2: length 57.6
  Top Layer w0.508: 94.74,43.74 90.93,43.74 82.09,34.9 C71.2 82.09,31.98 R82.2 81.54,31.43 U68.7
  Bottom Layer w0.508: 94.74,43.74 96.9,41.58 96.9,19.74 93.63,16.47 DB09.2
I2C1_SCL: length 29.4
  Top Layer w0.254: I2C1.1 29.72,56.63 29.72,40.21 31.38,38.54 STM32F103RCT6.58
I2C1_SDA: length 27.6
  Top Layer w0.254: STM32F103RCT6.59 31.09,38.04 29.21,39.93 29.21,54.64 I2C1.2
LIN: length 10.4
  Top Layer w0.381: U81.6 84.33,18.72 85.22,17.83 89.66,17.83 90.93,16.56 90.93,15.87 DB09.6
MS1: length 6.2
  Top Layer w0.254: R106.1 85.09,66.36 U80.2 85.22,63.55 H1.6
MS2: length 5.9
  Top Layer w0.254: H1.4 82.68,63.55 U80.3 82.66,63.79 R105.1
MS3: length 6
  Top Layer w0.254: H1.2 80.14,63.55 U80.4 80.01,66.74 R104.1
PA0_TIM5_PWM: length 63.9
  Top Layer w0.254: STM32F103RCT6.14 44.79,37.69 42.67,39.8 41.35,39.8 34.42,46.74 34.42,53.39 v1(34.67,53.64)
  Bottom Layer w0.254: U71.1 27.27,84.67 28.83,83.11 28.83,54.66 29.84,53.64 v1(34.67,53.64)
PA1_TIM5_PWM: length 73.5
  Top Layer w0.254: STM32F103RCT6.15 45.29,42.54 46.86,44.12 46.86,48.56 53.59,55.3 v1(54.36,55.3)
  Bottom Layer w0.254: U75.1 35.28,82.98 43.05,82.98 44.58,81.46 44.58,56.57 45.85,55.3 v1(54.36,55.3)
PA4_DAC: length 79.4
  Top Layer w0.254: STM32F103RCT6.20 52.16,37.04 v1(53.97,35.23)
  Bottom Layer w0.254: v1(53.97,35.23) 66.68,35.23 67.94,36.5 67.94,79.55 70.61,82.22 70.61,83.87 72.9,86.16 74.55,86.16 75.31,86.92 75.31,88.51 DAC.1
PA5_DAC: length 74.2
  Top Layer w0.254: v1(53.97,36.75) 53.19,37.54 STM32F103RCT6.21
  Bottom Layer w0.254: DAC.2 73,87.41 69.72,84.12 69.72,82.09 67.5,79.87 67.5,37.45 65.91,35.86 54.86,35.86 v1(53.97,36.75)
PA6_ADC: length 51.4
  Top Layer w0.254: v1(54.61,33.96) 54.99,34.34 54.99,37.39 54.34,38.04 STM32F103RCT6.22
  Bottom Layer w0.254: v1(54.61,33.96) 55.25,33.33 63.5,33.33 67.44,29.39 67.44,15.42 75.31,7.54 U83.4
PA7_ADC: length 51.7
  Top Layer w0.254: v1(54.74,32.44) 55.5,33.2 55.5,37.64 54.6,38.54 STM32F103RCT6.23
  Bottom Layer w0.254: U83.3 73.28,8.81 66.93,15.16 66.93,29.13 63.25,32.82 55.12,32.82 v1(54.74,32.44)
PA8: length 80.3
  Top Layer w0.254: v1(45.59,53.64) 44.98,53.64 41.79,50.45 STM32F103RCT6.41 ; v1(59.06,58.6) 58.67,58.22 U82.1
  Top Layer w0.508: U82.1 v1(58.67,53.64) R103.1
  Bottom Layer w0.254: STEP_LOGIC.2 66.78,84.76 68.2,84.76 69.47,86.03 69.47,90.22 68.45,91.24 64.13,91.24 63.5,90.6 63.5,59.66 62.44,58.6 v1(59.06,58.6) ; v1(45.59,53.64) v1(58.67,53.64)
PA8_OUT: length 17.4
  Top Layer w0.254: U82.2 59.94,58.72 60.32,59.11 69.47,59.11 69.98,59.61 69.98,63.55 U80.8
PA15: length 83.8
  Top Layer w0.254: STM32F103RCT6.50 34.22,42.54 33.91,42.85 33.91,53.9 v1(34.67,54.66)
  Top Layer w0.508: R101.1 v1(63.75,53.64) U82.5
  Bottom Layer w0.254: STEP_LOGIC.3 64.26,87.36 64.01,87.11 64.01,55.93 ; 64.01,55.93 64.01,56.14 ; 64.01,55.93 62.74,54.66 ; 62.74,54.66 v1(63.75,53.64) ; 62.74,54.66 v1(34.67,54.66)
PA15_OUT: length 28.4
  Top Layer w0.254: U82.6 65.02,57.58 65.28,57.84 71.88,57.84 73.91,59.87 86.36,59.87 87.63,61.14 U80.1
PB0: length 41.9
  Top Layer w0.254: STM32F103RCT6.26 55.26,40.04 57.02,38.28 57.02,33.45 59.88,30.59 U77.5
PB1/BUT1: length 57
  Top Layer w0.254: v1(45.97,40.44) 46.08,40.54 STM32F103RCT6.27
  Bottom Layer w0.254: R98.1 35.32,18.45 35.29,18.42 ; KEY1.3 35.29,18.42 ; 35.29,18.42 KEY1.4 38.25,20.39 39.12,21.26 46.74,21.26 47.5,22.02 47.5,31.04 41.02,37.52 41.02,40.06 41.4,40.44 v1(45.97,40.44)
PB2/BUT2: length 30.6
  Top Layer w0.254: v1(45.97,41.58) 46.51,41.04 STM32F103RCT6.28
  Bottom Layer w0.254: KEY2.4 55.23,19.52 R99.1 52.69,25.96 50.55,25.96 49.91,26.59 49.91,31.78 46.69,35 46.69,40.87 v1(45.97,41.58)
PB12/BUT3: length 53.6
  Top Layer w0.254: STM32F103RCT6.33 45.79,43.81 44.07,42.09 v1(44.07,39.67)
  Bottom Layer w0.254: v1(44.07,39.67) 44.63,39.67 44.88,39.42 44.88,36.14 49.28,31.75 49.28,16.81 50.04,16.05 60.96,16.05 61.75,16.84 KEY3.3 64.12,18.57 64.66,19.12 R100.1
PC0_ADC: length 58.1
  Top Layer w0.254: STM32F103RCT6.8 41.79,38.66 v1(41.91,38.79)
  Bottom Layer w0.254: U83.1 68.28,9.24 67.94,9.58 49.78,9.58 48.13,11.23 48.13,31.29 41.91,37.52 v1(41.91,38.79)
PC1_ADC: length 59.8
  Top Layer w0.254: v1(42.67,38.79) 42.67,37.9 42.29,37.51 STM32F103RCT6.9
  Bottom Layer w0.254: U83.2 70.78,9.16 69.85,10.08 50.16,10.08 48.77,11.48 48.77,31.42 42.67,37.52 v1(42.67,38.79)
PC2: length 28
  Top Layer w0.254: U79.5 41.28,7.87 41.28,19.23 44.32,22.28 44.32,27.99 42.79,29.53 STM32F103RCT6.10
PC3/LED: length 64.6
  Top Layer w0.254: v1(53.9,26.49) 53.9,9.06 U77.2 49.84,10.08 42.67,10.08 41.91,10.85 41.91,19.1 44.96,22.15 44.96,27.99 43.29,29.66 STM32F103RCT6.11 43.29,36.73 v1(43.94,37.39)
  Bottom Layer w0.254: LED7.2 51.44,27.33 52.22,26.54 53.85,26.54 v1(53.9,26.49)
PC4: length 41.8
  Top Layer w0.254: U77.3 58.8,11.46 58.8,30.23 56.01,33.02 56.01,37.77 54.73,39.04 STM32F103RCT6.24
PC5: length 41.8
  Top Layer w0.254: STM32F103RCT6.25 55,39.54 56.51,38.02 56.51,33.2 59.31,30.4 59.31,10.21 57.38,8.29 U77.4
PC6_TIM3_PWM: length 46.7
  Top Layer w0.254: U76.1 55.67,84.67 53.34,82.35 53.34,58.09 43.79,48.54 STM32F103RCT6.37
PC7_TIM3_PWM: length 45.8
  Top Layer w0.254: STM32F103RCT6.38 43.29,48.8 52.83,58.34 52.83,83.11 51.56,84.38 50.01,84.38 U74.1
PC8_TIM3_PWM: length 52.9
  Top Layer w0.254: STM32F103RCT6.39 42.79,49.19 52.32,58.72 52.32,82.35 51.69,82.98 43.35,82.98 U72.1
PC9_TIM3_PWM: length 74.2
  Top Layer w0.254: v1(44.83,52.5) 42.29,49.96 STM32F103RCT6.40
  Top Layer w0.508: U82.3 v1(61.21,53.64) R102.1
  Bottom Layer w0.254: STEP_LOGIC.4 67.8,89.86 68.07,89.59 68.07,86.54 67.69,86.16 64.77,86.16 64.52,85.9 64.52,53.01 64.13,52.63 62.23,52.63 v1(61.21,53.64) 60.45,52.88 45.21,52.88 v1(44.83,52.5)
PC9_TIM3_PWM_OUT: length 16.9
  Top Layer w0.254: U82.4 62.48,58.09 62.87,58.47 71.37,58.47 72.39,59.49 U80.7
PC13: length 27.9
  Top Layer w0.254: STM32F103RCT6.2 38.79,32.23 34.1,27.54 U79.2
PC14: length 28.8
  Top Layer w0.254: STM32F103RCT6.3 39.29,31.97 34.54,27.23 34.54,9.6 U79.3
PC15: length 29.6
  Top Layer w0.254: STM32F103RCT6.4 39.79,31.71 35.05,26.97 35.05,11.59 U79.4
RST1: length 27.6
  Top Layer w0.254: v1(39.37,35.61) 40.51,35.61 41.28,34.85 41.28,33.56 STM32F103RCT6.7
  Bottom Layer w0.254: v1(39.37,35.61) 39.37,32.71 R88.1 34.15,27.34 32.26,25.45 27.05,25.45 26.05,26.45 C89.1 25.97,27.44 RST1.2
SPI1_MISO: length 36.1
  Top Layer w0.254: STM32F103RCT6.56 31.88,39.54 30.73,40.69 30.73,63.08 SPI1.4
SPI1_MOSI: length 34.3
  Top Layer w0.254: STM32F103RCT6.57 31.62,39.04 30.23,40.44 30.23,61.08 SPI1.5
SPI1_SCK: length 38
  Top Layer w0.254: SPI1.3 31.24,65.07 31.24,40.94 32.14,40.04 STM32F103RCT6.55
SPI2_MISO: length 30.3
  Top Layer w0.254: STM32F103RCT6.35 44.79,48.01 54.36,57.58 54.36,61.01 58.93,65.58 58.93,68 58.39,68.54 SPI2.4
SPI2_MOSI: length 26.6
  Top Layer w0.254: SPI2.5 57.7,65.63 53.85,61.77 53.85,57.84 44.29,48.28 STM32F103RCT6.36
SPI2_SCK: length 66.8
  Top Layer w0.254: v1(54.23,47.8) 54.36,47.8 54.94,48.39 54.94,56.36 54.45,56.85 54.45,56.92 ; 54.45,56.92 45.29,47.75 STM32F103RCT6.34 ; 54.45,56.92 54.86,57.33 54.86,60.76 59.94,65.84 59.94,68.89 57.79,71.04 SPI2.3
  Top Layer w0.508: 64.57,41.26 64.6,41.28 64.81,41.28 ; 64.57,41.26 v1(64.52,41.2) 64.56,41.16 64.57,41.16 ; 64.57,41.26 64.57,41.16 ; 64.57,41.26 U21.2 ; 64.57,41.16 64.57,41.05 ; 64.57,41.16 64.68,41.16 ; 64.57,41.05 64.68,41.16 ; 64.57,41.05 U21.3 ; 64.68,41.16 64.81,41.28 ; 64.81,41.28 64.85,41.33 66.42,41.33 67.82,39.93 67.82,37.14 R92.1
  Bottom Layer w0.254: v1(54.23,47.8) 57.91,44.12 64.13,44.12 64.52,43.74 v1(64.52,41.2)
SWCLK: length 46.7
  Top Layer w0.254: STM32F103RCT6.49 35.37,43.04 v1(34.67,43.74)
  Bottom Layer w0.254: v1(34.67,43.74) 29.72,43.74 22.48,36.5 22.48,9.58 23.47,8.58 CN1.3
SWDIO: length 51.6
  Top Layer w0.254: v1(39.62,43.1) 39.29,43.44 STM32F103RCT6.46
  Bottom Layer w0.254: v1(39.62,43.1) 39.5,42.98 29.97,42.98 22.99,35.99 22.99,10.28 CN1.4
UART1_RX: length 99.7
  Top Layer w0.254: STM32F103RCT6.43 40.79,56.76 49.91,65.89 UART1.1 ; v1(76.33,21.26) U81.1 ; v1(72.26,47.93) 72.14,47.8 57.78,47.8 56.39,49.2 56.39,57.2 v1(56.64,57.45)
  Bottom Layer w0.254: v1(56.64,57.45) 54.74,59.36 54.74,67.49 52.58,69.65 50.99,69.65 UART1.1 ; v1(72.26,47.93) 73.41,47.93 75.95,45.39 75.95,21.64 v1(76.33,21.26)
UART1_TX: length 110.5
  Top Layer w0.254: v1(57.15,58.6) 57.4,58.34 57.4,56.95 56.9,56.44 56.9,49.33 57.91,48.31 71.12,48.31 71.63,48.82 v1(73.53,48.82) ; STM32F103RCT6.42 41.29,56.37 51.44,66.52 51.44,70.66 51.03,71.06 UART1.2 ; v1(76.33,17.45) U81.4
  Bottom Layer w0.254: UART1.2 50.69,70.28 52.71,70.28 55.25,67.74 55.25,59.87 56.51,58.6 v1(57.15,58.6) ; v1(76.33,17.45) 77.6,18.72 77.6,21.26 76.45,22.4 76.45,45.9 v1(73.53,48.82)
UART2_RX: length 70.9
  Top Layer w0.254: v1(49.66,34.72) 49.66,35.23 49.34,35.54 STM32F103RCT6.17 ; UART2.1 75.12,68.5 72.52,68.5 67.26,63.25 v1(66.07,63.25) ; U21.1 65.07,43.15 65.22,43.3 65.22,46.03 ; v1(62.87,43.1) 62.82,43.15
  Top Layer w0.508: U21.1 61.49,43.15 ; 60.98,43.15 61.49,43.15 ; 61.49,43.15 R93.1
  Bottom Layer w0.254: v1(49.66,34.72) 52.07,34.72 52.58,35.23 52.58,41.58 54.1,43.1 v1(62.87,43.1) 62.87,40.31 63.11,40.06 65.66,40.06 66.17,40.57 66.17,63.14 v1(66.07,63.25)
UART2_TX: length 68.8
  Top Layer w0.254: 65.6,36.38 65.6,38.84 65.1,39.34 U21.4 ; v1(66.78,64.16) 67.41,64.16 74.19,70.94 UART2.2 ; v1(62.48,39.29) 62.53,39.34 ; STM32F103RCT6.16 49.21,33.54 v1(49.4,33.35)
  Top Layer w0.508: 60.9,39.34 61.41,39.34 ; 61.41,39.34 U21.4 ; 61.41,39.34 R91.1
  Bottom Layer w0.254: v1(66.78,64.16) 66.78,40.28 65.79,39.29 v1(62.48,39.29) 54.23,39.29 53.09,38.15 53.09,34.72 51.71,33.35 v1(49.4,33.35)
UART3_RX: length 41.6
  Top Layer w0.254: 66.04,68.56 66.42,68.18 66.42,66.22 65.91,65.71 60.58,65.71 55.37,60.5 55.37,42.6 55.12,42.34 49.53,42.34 49.23,42.04 STM32F103RCT6.30
UART3_TX: length 46.8
  Top Layer w0.254: 66.04,71.06 66.78,71.06 67.69,70.16 67.69,65.96 66.8,65.08 60.71,65.08 55.88,60.25 55.88,42.22 55.5,41.83 49.78,41.83 49.49,41.54 STM32F103RCT6.29
UART4_RX: length 34.2
  Top Layer w0.254: UART4.1 40.57,68.56 33.02,61.01 33.02,42.22 33.69,41.54 STM32F103RCT6.52
UART4_TX: length 36.3
  Top Layer w0.254: STM32F103RCT6.51 33.95,42.04 33.4,42.6 33.4,56.82 43.31,66.73 43.31,69.52 UART4.2
UART5_RX: length 32.7
  Top Layer w0.254: STM32F103RCT6.54 32.66,40.54 31.88,41.33 31.88,64.95 33.61,66.68 UART5.1
UART5_TX: length 35.3
  Top Layer w0.254: STM32F103RCT6.53 33.05,41.04 32.51,41.58 32.51,63.17 35.31,65.96 35.31,69.37 UART5.2
USB_DM: length 123.9
  Top Layer w0.254: 92.67,74.85 USB_C1.B7 ; 92.67,74.85 94.11,74.85 94.23,74.98 94.23,75.62 93.99,75.86 USB_C1.A7 ; 92.67,74.85 82.93,74.85 80.39,77.39 80.39,89.84 78.87,91.36 38.61,91.36 37.59,90.35 37.59,83.49 45.09,76 45.09,62.15 40.29,57.36 STM32F103RCT6.44
USB_DP: length 122.9
  Top Layer w0.254: USB_C1.B6 91.29,76.36 91.19,76.25 91.19,75.82 ; STM32F103RCT6.45 39.79,57.62 44.45,62.28 44.45,76 37.08,83.36 37.08,90.6 38.35,91.87 79.12,91.87 80.9,90.09 80.9,77.65 82.68,75.87 91.13,75.87 91.19,75.82 ; 91.19,75.82 91.19,75.49 91.32,75.36 USB_C1.A6
$1N1838: length 11.4
  Top Layer w0.254: C1.2 38.05,25.95 X1.1 39.76,27.66 R32.2 40.29,29.92 STM32F103RCT6.5
$1N1839: length 11.5
  Top Layer w0.254: STM32F103RCT6.6 40.79,29.87 R32.1 41.27,27.87 X1.2 43.25,25.89 C2.2
$1N2268: length 23.7
  Top Layer w0.508: 19.56,55.76 18.04,57.28 12.11,57.28 10.8,58.6 10.8,70.08 L7.1
$1N2271: length 2.4
  Top Layer w0.254: R87.2 13.12,86.48 5V.1
$1N2571: length 2.6
  Top Layer w1.27: 3.3V.1 24.88,40.97 R84.2
$1N3602: length 2.2
  Top Layer w0.508: R89.1 63.4,36.38
$1N3604: length 1.9
  Top Layer w0.508: R90.1 63.02,46.03
$1N6121: length 2.3
  Bottom Layer w0.254: R97.2 53.69,31.12 51.44,31.12
$1N6470: length 19.5
  Top Layer w0.508: L9.1 10.22,21.22 C93.2 12.02,17.27 D11.1
  Top Layer w1.778: L9.1 7.87,27.1 6.19,28.78 C73.1
$1N6472: length 4.6
  Top Layer w0.508: D11.2 16.42,11.45 15.95,10.97
$1N7969: length 15.9
  Top Layer w1.27: CN3.1 93.02,59.17 87.5,53.64 83.44,53.64 82.55,52.76 U80.14
$1N7972: length 19.8
  Top Layer w1.27: CN3.2 93.83,61.52 91.95,61.52 86.11,55.68 82.3,55.68 80.01,53.39 U80.13
$1N7975: length 24
  Bottom Layer w1.27: U80.12 81.15,54.66 87.88,54.66 89.92,56.69 89.92,60.1 CN3.3
$1N7978: length 27.7
  Bottom Layer w1.27: U80.11 74.93,51.49 79.88,56.44 86.61,56.44 87.88,57.71 87.88,60.88 93.67,66.67 CN3.4
$1N8015: length 2.5
  Top Layer w0.254: U80.6 U80.5

## Copper pours and planes (outline as drawn; the poured copper is in the pictures)
3.3V on Top Layer: 49.57,36.66 52.12,36.66 52.12,34.95 49.57,34.95
3.3V on Top Layer: 12.45,49.96 33.27,49.96 33.27,34.58 12.45,34.58
3.3V on Top Layer: 49.49,46.25 52.81,46.25 52.81,44.27 49.49,44.27
3.3V on Top Layer: 45.47,30.86 46.93,30.86 46.93,26.89 45.47,26.89
3.3V on Top Layer: 35.65,49.55 39.22,49.55 39.22,48.07 35.65,48.07
3.3V on Bottom Layer: 45.46,31.13 46.94,31.13 46.94,26.34 45.46,26.34
3.3V on Bottom Layer: 12.47,49.25 17.88,49.25 17.88,39.28 12.47,39.28
+5V on Top Layer: 0.64,82.98 19.47,82.98 19.47,68.31 0.64,68.31
+12V on Top Layer: 5.33,56.19 16.51,56.19 16.51,42.34 5.33,42.34
GND on Top Layer: 0,93 100,93 100,0 0,0
GND on Bottom Layer: 0,93 100,93 100,0 0,0
BF12 on Top Layer: 3.68,19.86 13.21,19.86 13.21,8.43 3.68,8.43
$1N2268 on Top Layer: 10.11,76.12 21.08,76.12 21.08,54.53 10.11,54.53
$1N6470 on Top Layer: 4.83,31.17 13.72,31.17 13.72,13.91 4.83,13.91
$1N6472 on Top Layer: 14.9,16.84 18.08,16.84 18.08,8.43 14.9,8.43

## Text on the board
Bottom Silkscreen Layer: +5V | SCL | SDA | GND | CLK | DIO | PC13 | PC14 | PC15 | PC2 | PC3 | PC4 | PC5 | PB0 | PC0 | PC1 | PA7 | PA6 | A | B | L | H | A / B / C / D | 4:485_A / 9:485_B / 2:CAN_L / 7:CAN_H / 6:LIN_12 / 1:GND | ST-Link | OUT1 | OUT2 | ADC | EPT Team / Test Kit V1 | RST | PC3_LED | + 12V - | PB1/BUT1 | PB2/BUT2 | PB12/BUT3 | I2C | CAN | 485 | S / T / E / P | USB
Top Silkscreen Layer: SV_PA0 | SV_PA1 | SV_PC8 | SV_PC7 | SV_PC6 | +5V | +12V | +3.3V | EPT Kit V1 / + 1 Can Port / + 1 485 Port / + 1 LIN Port / + PWM out / + Relay Control / --------- | We are VietNamese
